# EAGLE design Amstrad-CPC-8255-PIO-2-0 (EAGLE 9.6.2)
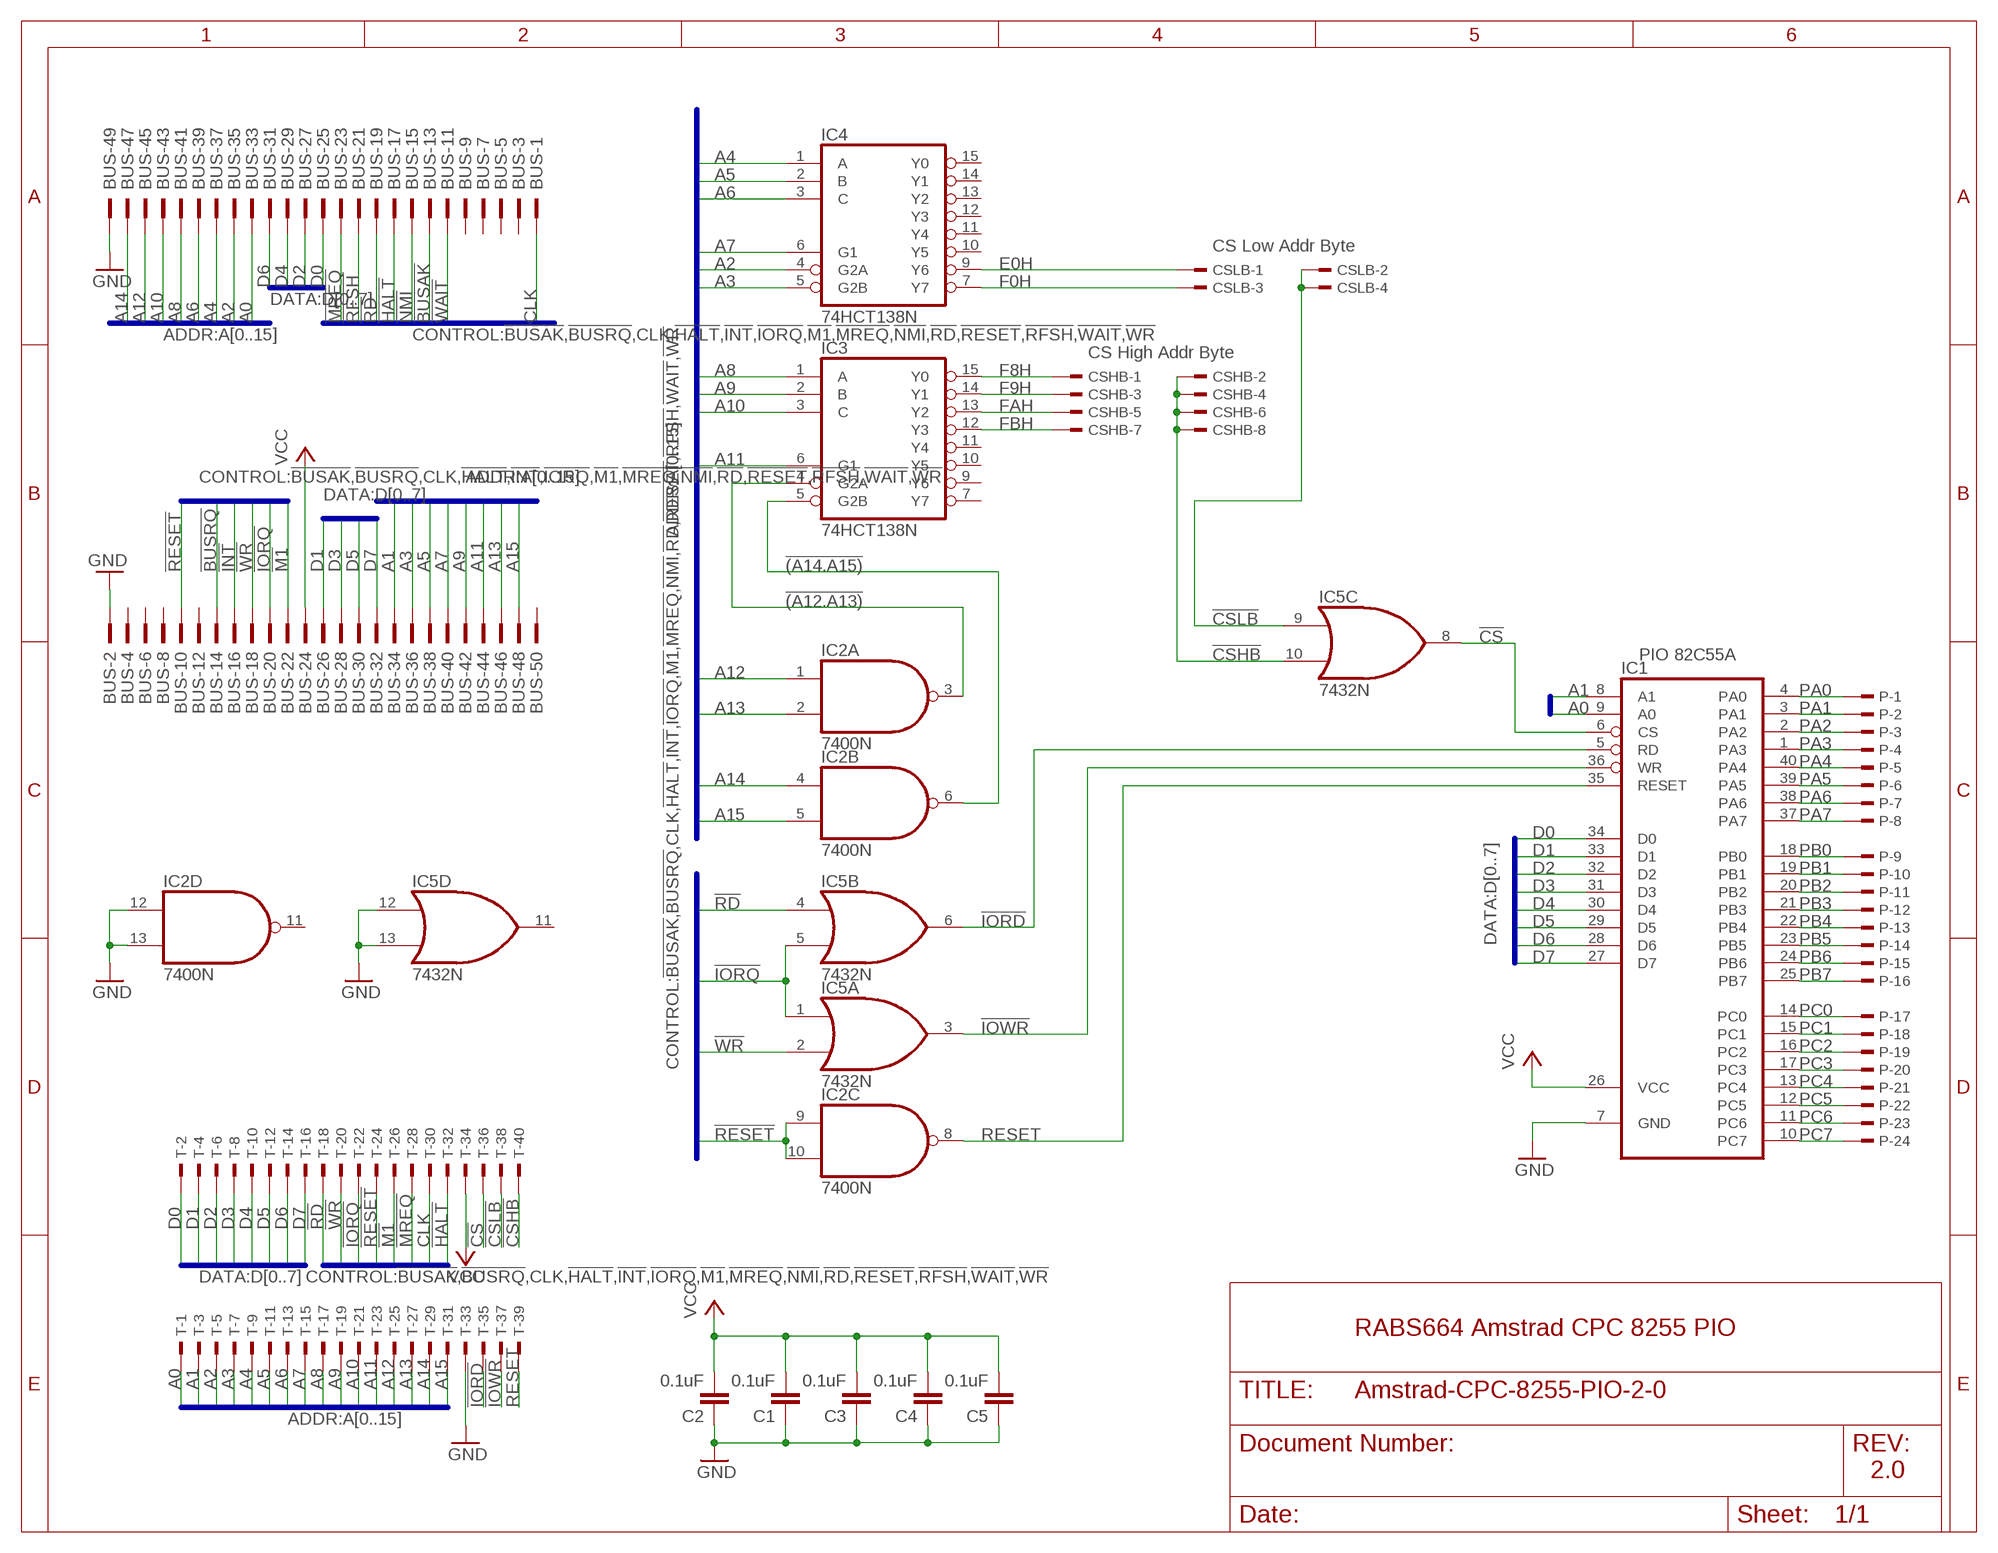
[diagram p0: schematic, sheet 1]

## Parts
BUS  2550-  [PAK100/2500-50]
C1  0.1uF  C-EU050-025X075  [C050-025X075]
C2  0.1uF  C-EU050-025X075  [C050-025X075]
C3  0.1uF  C-EU050-025X075  [C050-025X075]
C4  0.1uF  C-EU050-025X075  [C050-025X075]
C5  0.1uF  C-EU050-025X075  [C050-025X075]
CSHB  TSW-104-07-G-D  [TSW-104-XX-G-D]
CSLB  TSW-102-07-G-D  [TSW-102-XX-G-D]
IC1  82C55A  [DIL40]
IC2  7400N  [DIL14]
IC3  74HCT138N  [DIL16]
IC4  74HCT138N  [DIL16]
IC5  7432N  [DIL14]
P  TSW-124-07-G-S  [TSW-124-XX-G-S]
T  TSW-120-07-G-D  [TSW-120-XX-G-D]

## Nets
!(A12.A13): IC2.3(A:O) IC3.4(G2A)
!(A14.A15): IC2.6(B:O) IC3.5(G2B)
!BUSAK: BUS.13
!BUSRQ: BUS.14
!CS: IC1.6(CS) IC5.8(C:O) T.36
!CSHB: CSHB.2 CSHB.4 CSHB.6 CSHB.8 IC5.10(C:I1) T.40
!CSLB: CSLB.2 CSLB.4 IC5.9(C:I0) T.38
!HALT: BUS.17 T.32
!INT: BUS.16
!IORD: IC1.5(RD) IC5.6(B:O) T.35
!IORQ: BUS.20 IC5.1(A:I0) IC5.5(B:I1) T.22
!IOWR: IC1.36(WR) IC5.3(A:O) T.37
!M1: BUS.22 T.26
!MREQ: BUS.23 T.28
!NMI: BUS.15
!RD: BUS.19 IC5.4(B:I0) T.18
!RESET: BUS.10 IC2.9(C:I0) IC2.10(C:I1) T.24
!RFSH: BUS.21
!WAIT: BUS.11
!WR: BUS.18 IC5.2(A:I1) T.20
A0: BUS.33 IC1.9(A0) T.1
A1: BUS.34 IC1.8(A1) T.3
A2: BUS.35 IC4.4(G2A) T.5
A3: BUS.36 IC4.5(G2B) T.7
A4: BUS.37 IC4.1(A) T.9
A5: BUS.38 IC4.2(B) T.11
A6: BUS.39 IC4.3(C) T.13
A7: BUS.40 IC4.6(G1) T.15
A8: BUS.41 IC3.1(A) T.17
A9: BUS.42 IC3.2(B) T.19
A10: BUS.43 IC3.3(C) T.21
A11: BUS.44 IC3.6(G1) T.23
A12: BUS.45 IC2.1(A:I0) T.25
A13: BUS.46 IC2.2(A:I1) T.27
A14: BUS.47 IC2.4(B:I0) T.29
A15: BUS.48 IC2.5(B:I1) T.31
CLK: BUS.1 T.30
D0: BUS.25 IC1.34(D0) T.2
D1: BUS.26 IC1.33(D1) T.4
D2: BUS.27 IC1.32(D2) T.6
D3: BUS.28 IC1.31(D3) T.8
D4: BUS.29 IC1.30(D4) T.10
D5: BUS.30 IC1.29(D5) T.12
D6: BUS.31 IC1.28(D6) T.14
D7: BUS.32 IC1.27(D7) T.16
E0H: CSLB.1 IC4.9(Y6)
F0H: CSLB.3 IC4.7(Y7)
F8H: CSHB.1 IC3.15(Y0)
F9H: CSHB.3 IC3.14(Y1)
FAH: CSHB.5 IC3.13(Y2)
FBH: CSHB.7 IC3.12(Y3)
GND [supply]: BUS.2 BUS.49 C1.1 C2.1 C3.1 C4.1 C5.1 IC1.7(GND) IC2.12(D:I0) IC2.13(D:I1) IC5.12(D:I0) IC5.13(D:I1) T.33
PA0: IC1.4(PA0) P.1
PA1: IC1.3(PA1) P.2
PA2: IC1.2(PA2) P.3
PA3: IC1.1(PA3) P.4
PA4: IC1.40(PA4) P.5
PA5: IC1.39(PA5) P.6
PA6: IC1.38(PA6) P.7
PA7: IC1.37(PA7) P.8
PB0: IC1.18(PB0) P.9
PB1: IC1.19(PB1) P.10
PB2: IC1.20(PB2) P.11
PB3: IC1.21(PB3) P.12
PB4: IC1.22(PB4) P.13
PB5: IC1.23(PB5) P.14
PB6: IC1.24(PB6) P.15
PB7: IC1.25(PB7) P.16
PC0: IC1.14(PC0) P.17
PC1: IC1.15(PC1) P.18
PC2: IC1.16(PC2) P.19
PC3: IC1.17(PC3) P.20
PC4: IC1.13(PC4) P.21
PC5: IC1.12(PC5) P.22
PC6: IC1.11(PC6) P.23
PC7: IC1.10(PC7) P.24
RESET: IC1.35(RESET) IC2.8(C:O) T.39
VCC [supply]: BUS.24 C1.2 C2.2 C3.2 C4.2 C5.2 IC1.26(VCC) T.34
Unconnected: BUS.3 BUS.4 BUS.5 BUS.6 BUS.7 BUS.8 BUS.9 BUS.12 BUS.50 IC2.11(D:O) IC3.7(Y7) IC3.9(Y6) IC3.10(Y5) IC3.11(Y4) IC4.10(Y5) IC4.11(Y4) IC4.12(Y3) IC4.13(Y2) IC4.14(Y1) IC4.15(Y0) IC5.11(D:O)

## Buses
ADDR:A[0..15]
DATA:D[0..7]
CONTROL:!BUSAK,!BUSRQ,CLK,!HALT,!INT,!IORQ,!M1,!MREQ,!NMI,!RD,!RESET,!RFSH,!WAIT,!WR

## Notes on the sheet
- CS Low Addr Byte
- CS High Addr Byte
- PIO 82C55A
- RABS664 Amstrad CPC 8255 PIO
- 2.0

## Power pins joined to a net without a drawn wire
GND: IC2.7(P:GND) IC3.8(GND) IC4.8(GND) IC5.7(P:GND)
VCC: IC2.14(P:VCC) IC3.16(VCC) IC4.16(VCC) IC5.14(P:VCC)

## Library data of the parts
BUS = con-3m:2550-: 3M (TM) Pak 100 4-Wall Header Source: 3M; OC_FARNELL: unknown; OC_NEWARK: unknown; SPICEPREFIX: X
C1-C5 = rcl:C-EU: CAPACITOR, European symbol; SPICEPREFIX: C
CSHB = con-samtec:TSW-104-*-G: THROUGH-HOLE .025" SQ POST HEADER Source: Samtec TSW.pdf; MF: Samtec Inc.; MPN: TSW-104-07-G-D
CSLB = con-samtec:TSW-102-*-G: THROUGH-HOLE .025" SQ POST HEADER Source: Samtec TSW.pdf; MF: Samtec Inc.; MPN: TSW-102-07-G-D
IC1 = micro-intel:82C55A: MICROCOMPUTER/PERIPHERAL DEVICE; MF: INTERSIL; MPN: IP82C55AZ; OC_FARNELL: 1562050; OC_NEWARK: 79K6939
IC2 = 74xx-us:74*00: Quad 2-input NAND gate
IC3 IC4 = 74xx-eu:74*138: 3-line to 8-line DECODER/DEMULTIPLEXER
IC5 = 74xx-us:74*32: Quad 2-input OR gate
P = con-samtec:TSW-124-*-G-S: THROUGH-HOLE .025" SQ POST HEADER Source: Samtec TSW.pdf; MF: Samtec Inc.; MPN: TSW-124-07-G-S
T = con-samtec:TSW-120-*-G: THROUGH-HOLE .025" SQ POST HEADER Source: Samtec TSW.pdf; MF: Samtec Inc.; MPN: TSW-120-07-G-D

## Net classes
0 default: width 0.254 mm, clearance 0.254 mm
1 supply: width 0.508 mm, clearance 0.508 mm

## Board
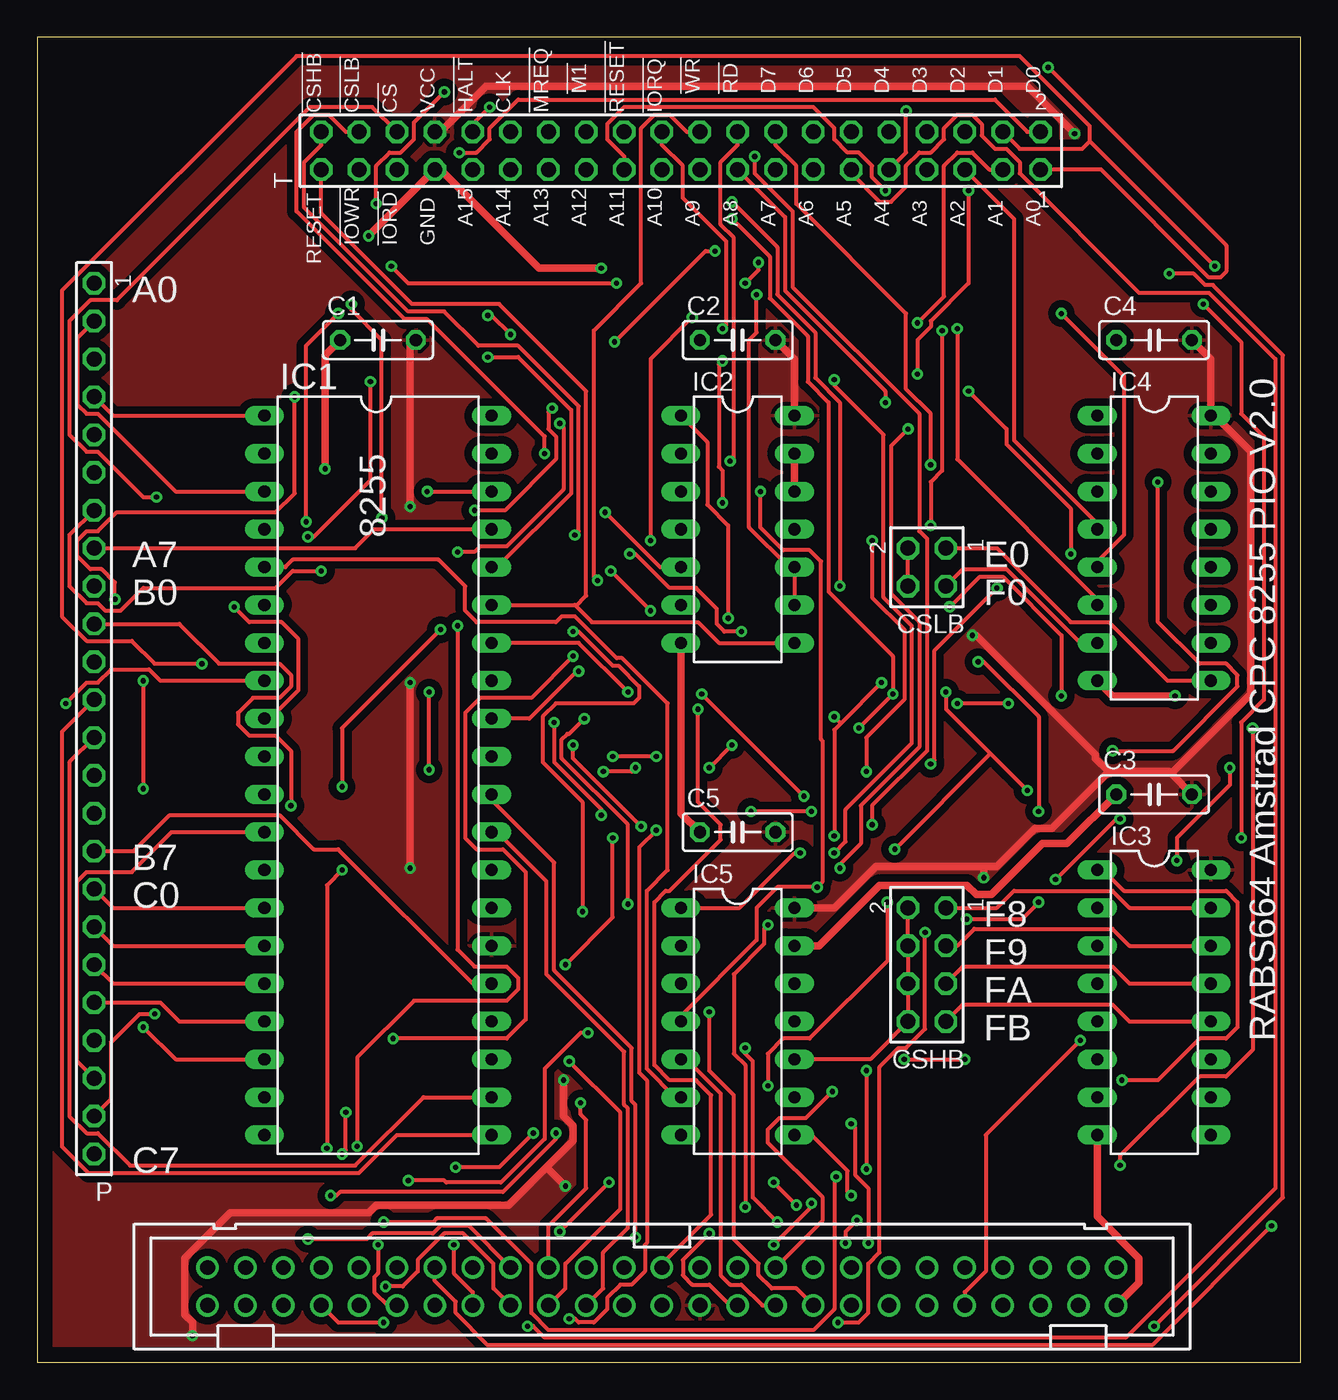
[diagram p1: board, top side]
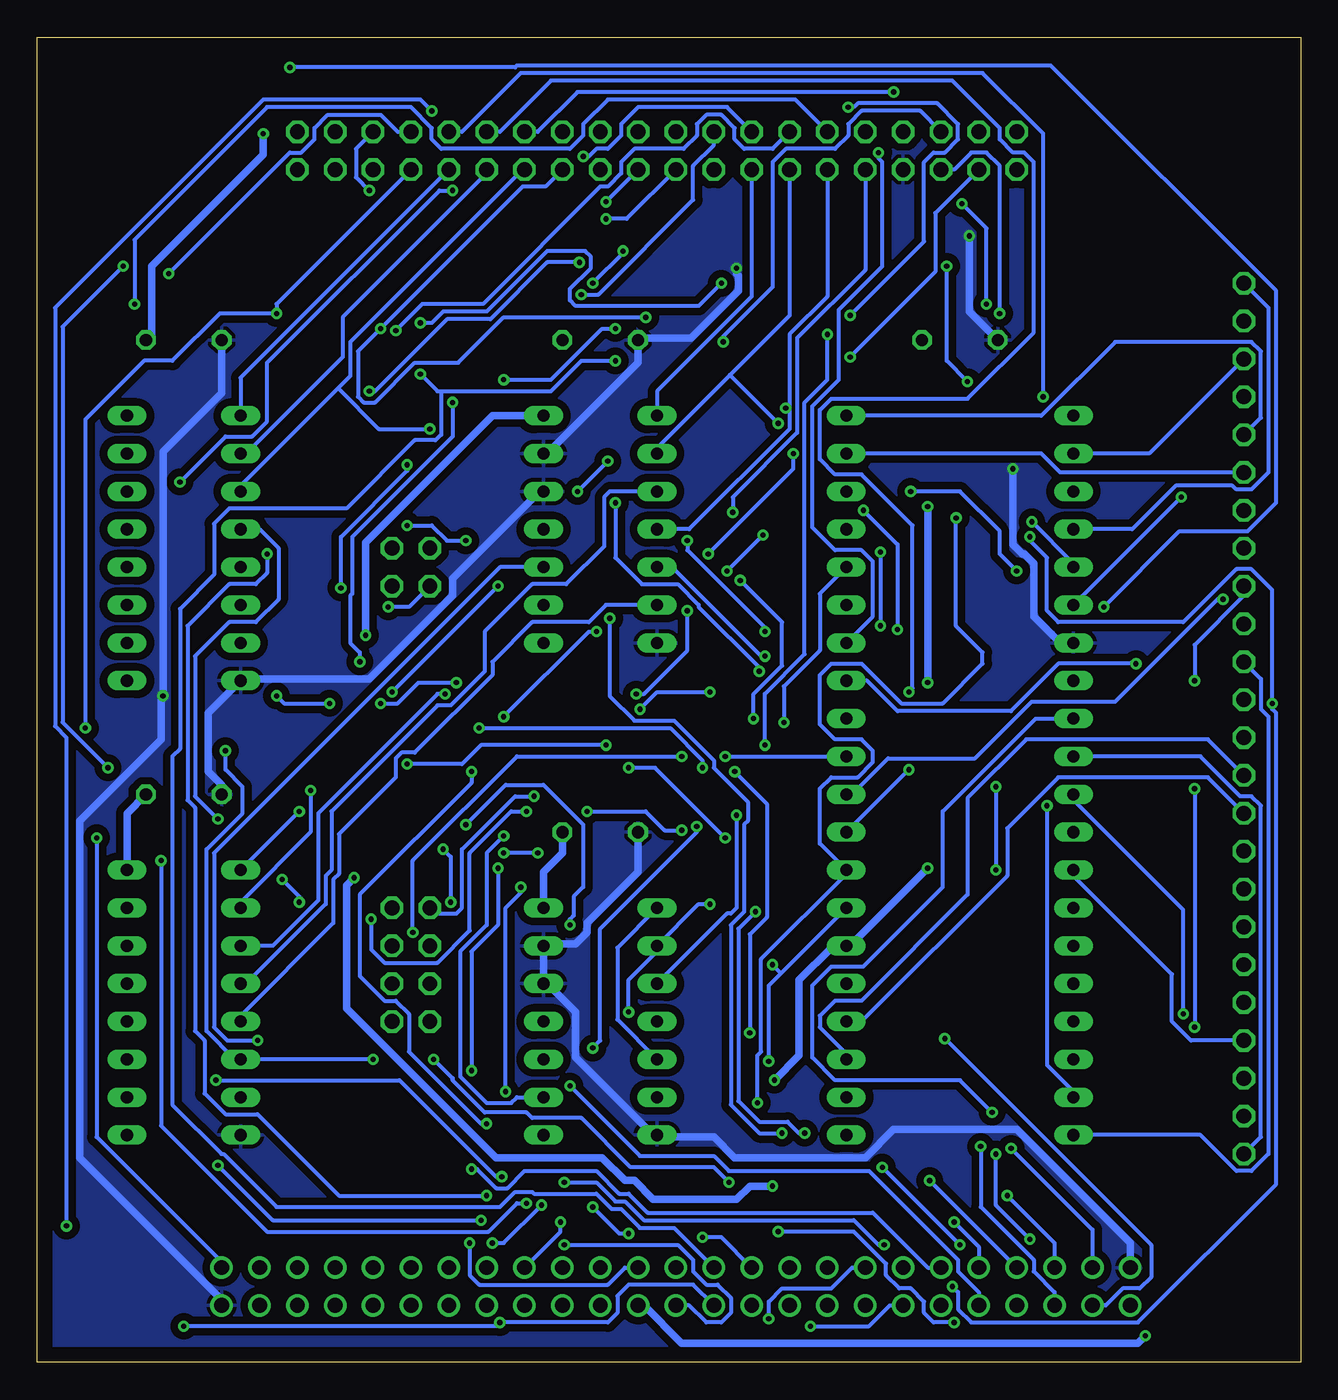
[diagram p2: board, bottom side, seen from below]

Size 84.76 x 88.89 mm. Coordinates in mm from the lower left corner, seen from the top.
Outline: 0,0 84.76,0 84.76,88.89 0,88.89 0,0
Copper layers (1*16): Top 0.035mm / dielectric 1.5mm / Bottom 0.035mm
Design rules "default": minimum track width 6mil, minimum drill 0.35mm, track to track 6mil, track to pad 6mil, pad to pad 6mil, via to via 6mil, smd to smd 6mil, copper to edge 40mil, drill to drill 6mil, minimum pad ring 10mil, minimum via ring 8mil, stop-mask expansion 4mil, vias tented up to drill 0mil, thermal gap 10mil

### Footprints (pad centres in the part's own frame; a part is rotated, then mirrored left to right if it is on the bottom)
PAK100/2500-50 = drill 1 pad 1.422: 1 -30.48,-1.27; 2 -30.48,1.27; 3 -27.94,-1.27; 4 -27.94,1.27; 5 -25.4,-1.27; 6 -25.4,1.27; 7 -22.86,-1.27; 8 -22.86,1.27; 9 -20.32,-1.27; 10 -20.32,1.27; 11 -17.78,-1.27; 12 -17.78,1.27; 13 -15.24,-1.27; 14 -15.24,1.27; 15 -12.7,-1.27; 16 -12.7,1.27; 17 -10.16,-1.27; 18 -10.16,1.27; 19 -7.62,-1.27; 20 -7.62,1.27; 21 -5.08,-1.27; 22 -5.08,1.27; 23 -2.54,-1.27; 24 -2.54,1.27; 25 0,-1.27; 26 0,1.27; 27 2.54,-1.27; 28 2.54,1.27; 29 5.08,-1.27; 30 5.08,1.27; 31 7.62,-1.27; 32 7.62,1.27; 33 10.16,-1.27; 34 10.16,1.27; 35 12.7,-1.27; 36 12.7,1.27; 37 15.24,-1.27; 38 15.24,1.27; 39 17.78,-1.27; 40 17.78,1.27; 41 20.32,-1.27; 42 20.32,1.27; 43 22.86,-1.27; 44 22.86,1.27; 45 25.4,-1.27; 46 25.4,1.27; 47 27.94,-1.27; 48 27.94,1.27; 49 30.48,-1.27; 50 30.48,1.27
C050-025X075 = drill 0.813 octagon: 1 -2.54,0; 2 2.54,0
TSW-104-XX-G-D = drill 1 pad 1.5 octagon: 1 3.81,-1.27; 2 3.81,1.27; 3 1.27,-1.27; 4 1.27,1.27; 5 -1.27,-1.27; 6 -1.27,1.27; 7 -3.81,-1.27; 8 -3.81,1.27
TSW-102-XX-G-D = drill 1 pad 1.5 octagon: 1 1.27,-1.27; 2 1.27,1.27; 3 -1.27,-1.27; 4 -1.27,1.27
DIL40 = drill 0.813 long: 1 -24.13,-7.62; 2 -21.59,-7.62; 3 -19.05,-7.62; 4 -16.51,-7.62; 5 -13.97,-7.62; 6 -11.43,-7.62; 7 -8.89,-7.62; 8 -6.35,-7.62; 9 -3.81,-7.62; 10 -1.27,-7.62; 11 1.27,-7.62; 12 3.81,-7.62; 13 6.35,-7.62; 14 8.89,-7.62; 15 11.43,-7.62; 16 13.97,-7.62; 17 16.51,-7.62; 18 19.05,-7.62; 19 21.59,-7.62; 20 24.13,-7.62; 21 24.13,7.62; 22 21.59,7.62; 23 19.05,7.62; 24 16.51,7.62; 25 13.97,7.62; 26 11.43,7.62; 27 8.89,7.62; 28 6.35,7.62; 29 3.81,7.62; 30 1.27,7.62; 31 -1.27,7.62; 32 -3.81,7.62; 33 -6.35,7.62; 34 -8.89,7.62; 35 -11.43,7.62; 36 -13.97,7.62; 37 -16.51,7.62; 38 -19.05,7.62; 39 -21.59,7.62; 40 -24.13,7.62
DIL14 = drill 0.813 long: 1 -7.62,-3.81; 2 -5.08,-3.81; 3 -2.54,-3.81; 4 0,-3.81; 5 2.54,-3.81; 6 5.08,-3.81; 7 7.62,-3.81; 8 7.62,3.81; 9 5.08,3.81; 10 2.54,3.81; 11 0,3.81; 12 -2.54,3.81; 13 -5.08,3.81; 14 -7.62,3.81
DIL16 = drill 0.813 long: 1 -8.89,-3.81; 2 -6.35,-3.81; 3 -3.81,-3.81; 4 -1.27,-3.81; 5 1.27,-3.81; 6 3.81,-3.81; 7 6.35,-3.81; 8 8.89,-3.81; 9 8.89,3.81; 10 6.35,3.81; 11 3.81,3.81; 12 1.27,3.81; 13 -1.27,3.81; 14 -3.81,3.81; 15 -6.35,3.81; 16 -8.89,3.81
TSW-124-XX-G-S = drill 1 pad 1.5 octagon: 1 29.21,0; 2 26.67,0; 3 24.13,0; 4 21.59,0; 5 19.05,0; 6 16.51,0; 7 13.97,0; 8 11.43,0; 9 8.89,0; 10 6.35,0; 11 3.81,0; 12 1.27,0; 13 -1.27,0; 14 -3.81,0; 15 -6.35,0; 16 -8.89,0; 17 -11.43,0; 18 -13.97,0; 19 -16.51,0; 20 -19.05,0; 21 -21.59,0; 22 -24.13,0; 23 -26.67,0; 24 -29.21,0
TSW-120-XX-G-D = drill 1 pad 1.5 octagon: 1 24.13,-1.27; 2 24.13,1.27; 3 21.59,-1.27; 4 21.59,1.27; 5 19.05,-1.27; 6 19.05,1.27; 7 16.51,-1.27; 8 16.51,1.27; 9 13.97,-1.27; 10 13.97,1.27; 11 11.43,-1.27; 12 11.43,1.27; 13 8.89,-1.27; 14 8.89,1.27; 15 6.35,-1.27; 16 6.35,1.27; 17 3.81,-1.27; 18 3.81,1.27; 19 1.27,-1.27; 20 1.27,1.27; 21 -1.27,-1.27; 22 -1.27,1.27; 23 -3.81,-1.27; 24 -3.81,1.27; 25 -6.35,-1.27; 26 -6.35,1.27; 27 -8.89,-1.27; 28 -8.89,1.27; 29 -11.43,-1.27; 30 -11.43,1.27; 31 -13.97,-1.27; 32 -13.97,1.27; 33 -16.51,-1.27; 34 -16.51,1.27; 35 -19.05,-1.27; 36 -19.05,1.27; 37 -21.59,-1.27; 38 -21.59,1.27; 39 -24.13,-1.27; 40 -24.13,1.27

### Placement (x,y rotation side)
BUS  41.91,5.08 180 top
C1  22.86,68.58 0 top
C2  46.99,68.58 0 top
C3  74.93,38.1 0 top
C4  74.93,68.58 0 top
C5  46.99,35.56 0 top
CSHB  59.69,26.67 90 top
CSLB  59.69,53.34 90 top
IC1  22.86,39.37 270 top
IC2  46.99,55.88 270 top
IC3  74.93,24.13 270 top
IC4  74.93,54.61 270 top
IC5  46.99,22.86 270 top
P  3.81,43.18 90 top
T  43.18,81.28 0 top

### Tracks (layer width: path | path; a pad name or v marks a point on that pad's centre or on a via)
!(A12.A13)
  Bottom 0.254: IC3.4 70.74,25.4 65.41,30.73 65.41,32.64 65.02,33.02 65.02,36.96 57.91,44.07 57.02,44.07 54.74,46.35 54.74,49.02 51.56,52.2 49.28,52.2 46.74,54.74 46.74,58.04 46.36,58.42 IC2.3
!(A14.A15)
  Bottom 0.254: IC3.5 71.12,23.24 64.9,29.46 64.9,32.38 64.52,32.77 64.52,35.43 60.71,39.24 60.71,40.51 60.33,40.89 59.44,40.89 54.23,46.1 54.23,46.99 51.56,49.66 47.75,49.66 46.61,50.8 IC2.6
!CS  (via drill 0.35)
  Top 0.254: v8,58.04 7.11,58.04 4.06,61.09 3.3,61.09 2.16,62.23 2.16,69.85 3.56,71.25 5.33,71.25 18.29,84.2 22.48,84.2 T.36 | IC5.8 51.94,15.24 54.36,12.83 54.36,11.43 v54.61,11.18 | v69.34,54.23 69.34,57.28 65.02,61.59 65.02,62.61 v62.48,65.15 | v48.39,73.79 48.39,73.28 v47.5,72.39 | v45.47,74.55 44.83,74.55 v38.74,68.45
  Bottom 0.254: v8,58.04 IC1.6 | v54.61,11.18 64.52,11.18 69.98,16.64 72.14,16.64 73.53,18.03 73.53,21.59 74.17,22.23 74.17,37.21 74.68,37.72 74.68,49.4 71.88,52.2 70.1,52.2 69.34,52.96 v69.34,54.23 | v62.48,65.15 62.1,65.15 57.28,69.98 54.36,69.98 50.55,73.79 v48.39,73.79 | v47.5,72.39 45.47,74.42 v45.47,74.55 | v38.74,68.45 38.74,68.83 35.43,72.14 35.43,80.52 34.54,81.41 31.24,81.41 30.35,82.3 30.35,83.06 29.46,83.95 25.53,83.95 T.36
!CSHB  (via drill 0.35)
  Top 0.254: IC5.10 55.88,20.32 CSHB.8 CSHB.6 CSHB.4 CSHB.2 | T.40 19.05,81.66 17.91,80.52 17.91,77.47 24.89,70.48 27.3,70.48 29.59,68.2 32.26,68.2 36.32,64.14 36.32,55.75 v36.07,55.5 | v41.15,50.42 v38.48,53.09 | v51.44,37.97 v44.58,44.83
  Bottom 0.254: v38.48,53.09 v36.07,55.5 | v41.15,50.42 41.15,47.75 44.07,44.83 v44.58,44.83 | v51.44,37.97 52.71,37.97 56.26,34.42 56.26,30.48 56.64,30.1 58.04,30.1 CSHB.2
!CSLB  (via drill 0.35)
  Top 0.254: v53.47,35.31 53.47,42.42 53.91,42.86 | v56.64,45.59 53.91,42.86 | v65.15,44.2 v61.72,44.2 | v68.71,44.7 68.71,48.77 64.77,52.7 63.25,52.7 v61.21,50.67 | CSLB.4 CSLB.2 | T.38 20.7,82.55 19.56,83.69 18.54,83.69 17.4,82.55 17.4,77.22 24.64,69.98 26.16,69.98 34.04,62.1 v34.04,60.96 | v39.75,54.23 40.13,54.23 42.42,51.94 44.2,51.94 45.59,50.55 45.59,49.53 46.1,49.02 v47.24,49.02 | 53.91,42.86 v53.47,43.31
  Bottom 0.254: IC5.9 52.58,17.78 52.96,17.4 54.61,17.4 56.39,19.18 56.39,27.56 54.61,29.34 54.61,34.16 v53.47,35.31 | v56.64,45.59 59.18,45.59 60.58,44.2 v61.72,44.2 | v65.15,44.2 68.2,44.2 v68.71,44.7 | v61.21,50.67 59.82,50.67 CSLB.4 | v34.04,60.96 34.04,59.94 v39.75,54.23 | v47.24,49.02 47.75,49.02 v53.47,43.31
!HALT  (via drill 0.35)
  Top 0.254: T.32 29.21,83.06 v30.35,84.2 | v30.23,70.23 30.48,70.23 v31.75,68.96 | v35.94,41.4 35.94,40.51 v40.51,35.94 | v47.5,21.08 47.5,20.7 48.01,20.19 48.01,11.05 v49.66,9.4
  Bottom 0.254: v30.35,84.2 29.97,84.2 29.72,84.45 24.38,84.45 22.99,83.06 22.99,82.04 23.88,81.15 24.64,81.15 25.27,80.52 25.27,75.18 v30.23,70.23 | v31.75,68.96 31.75,65.91 33.27,64.39 33.27,47.5 35.94,44.83 v35.94,41.4 | v40.51,35.94 40.51,35.56 46.99,29.08 46.99,21.59 v47.5,21.08 | v49.66,9.4 49.66,8.76 BUS.17
!IORD  (via drill 0.35)
  Top 0.254: IC1.5 16.64,53.34 17.14,53.85 26.92,53.85 28.7,52.07 28.7,50.42 29.46,49.66 34.8,49.66 35.18,50.04 36.07,50.04 38.86,47.24 39.24,47.24 42.29,44.2 42.29,33.02 40.89,31.62 40.89,19.68 42.8,17.78 IC5.6 | v20.19,70.36 18.03,68.2 v18.03,56.39
  Bottom 0.254: T.35 23.24,80.01 22.1,81.15 21.08,81.15 20.19,80.26 v20.19,70.36 | v18.03,56.39 15.24,53.59 IC1.5
!IORQ  (via drill 0.35)
  Top 0.254: BUS.20 48.64,3.81 47.24,5.21 46.48,5.21 45.85,5.84 45.85,18.03 43.56,20.32 IC5.5 | T.22 41.91,81.66 43.31,80.26 43.31,78.11 46.23,75.18 46.23,69.6 v45.97,69.34 | v53.47,65.91 53.47,65.53 56.77,62.23 56.77,51.31 58.67,49.4 58.67,41.53 54.23,37.08 54.23,34.92 v53.47,34.16 | v51.18,34.16 50.8,34.16 47.12,30.48 IC5.1
  Bottom 0.254: IC5.5 45.85,22.99 45.85,27.81 IC5.1 | v45.97,69.34 46.86,69.34 50.29,65.91 v53.47,65.91 | v51.18,34.16 v53.47,34.16
!IOWR  (via drill 0.35)
  Top 0.254: IC1.36 30.86,53.34 35.81,58.29 35.81,63.88 32.26,67.44 v30.23,67.44 | v37.85,36.7 37.85,37.08 34.67,40.26 v34.67,42.93
  Bottom 0.254: v30.23,67.44 24.51,73.15 24.51,77.09 T.37 | IC5.3 38.48,30.1 38.23,30.1 37.85,30.48 v37.85,36.7 | v34.67,42.93 34.67,45.34 32.26,47.75 32.26,51.56 IC1.36
!M1  (via drill 0.35)
  Top 0.254: BUS.22 46.48,3.81 45.09,5.21 43.94,5.21 43.31,5.84 43.31,6.86 v45.09,8.64 | v47.5,10.41 47.5,19.94 46.74,20.7 46.74,26.04 48.77,28.07 48.77,29.08 v49.02,29.34 | v56.01,36.07 56.01,37.34 59.69,41.02 59.69,55.24 59.18,55.75 59.18,63.63 50.67,72.14 50.67,77.22 48.13,79.76 v48.13,80.9
  Bottom 0.254: v45.09,8.64 45.72,8.64 v47.5,10.41 | v49.02,29.34 49.02,29.72 48.77,29.97 48.77,31.24 48.13,31.88 48.13,36.07 50.8,38.73 53.34,38.73 v56.01,36.07 | v48.13,80.9 47.75,80.9 47.24,81.41 46.48,81.41 45.59,82.3 45.59,83.06 44.45,84.2 38.48,84.2 T.26
!MREQ  (via drill 0.35)
  Top 0.254: v55.75,8 55.75,11.68 54.86,12.57 54.86,15.75 v54.61,16 | v55.63,39.62 55.63,41.91 58.17,44.45 58.17,49.15 56.01,51.31 v56.01,55.12 | v59.94,56.13 59.94,59.05 60.71,59.82 v60.71,69.22
  Bottom 0.254: BUS.23 45.34,6.35 46.48,5.21 55.12,5.21 55.75,5.84 v55.75,8 | v54.61,16 54.99,16 59.82,20.83 59.82,23.37 60.71,24.26 61.47,24.26 63.12,25.91 63.12,31.37 55.63,38.86 v55.63,39.62 | v56.01,55.12 57.28,55.12 58.29,56.13 v59.94,56.13 | v60.71,69.22 58.93,70.99 54.86,70.99 46.99,78.87 46.48,78.87 45.59,79.76 45.59,80.52 44.7,81.41 41.4,81.41 40.51,82.3 40.51,83.06 39.88,83.69 38.86,83.69 37.97,82.8 37.97,82.04 37.34,81.41 35.43,81.41 T.28
!RD  (via drill 0.35)
  Top 0.254: IC5.4 43.18,23.24 48.26,28.32 48.26,30.48 49.66,31.88 v52.32,31.88 52.71,32.26 52.71,41.66 52.58,41.78 52.58,53.72 51.82,54.48 50.04,54.48 48.51,56.01 v48.51,58.42 | v53.34,18.16 51.56,16.38 49.78,16.38 49.02,15.62 49.02,14.73 52.71,11.05 52.71,9.53 BUS.19 | T.18 46.99,81.66 45.85,80.52 45.85,76.33 46.74,75.44 46.74,60.71 v46.48,60.45
  Bottom 0.254: v52.32,31.88 52.32,31.5 53.34,30.48 v53.34,18.16 | v48.51,58.42 v46.48,60.45
!RESET  (via drill 0.35)
  Top 0.254: IC2.9 IC2.10 50.42,53.34 47.75,56.01 47.75,68.58 48.26,69.09 v48.26,71.63 | BUS.10 62.23,4.7 63.63,6.1 63.63,15.24 v69.98,21.59
  Bottom 0.254: v69.98,21.59 72.01,21.59 72.9,22.48 72.9,34.16 53.72,53.34 IC2.10 | T.24 39.37,81.66 40.77,80.26 40.77,77.98 47.12,71.63 v48.26,71.63
!WR  (via drill 0.35)
  Top 0.254: v45.09,23.5 45.09,19.56 46.74,17.91 46.74,8.26 48.39,6.6 48.39,5.84 49.28,4.95 50.93,4.95 BUS.18 | T.20 43.56,82.55 42.42,83.69 41.4,83.69 40.51,82.8 40.51,72.39 37.34,69.22 37.34,52.7 v37.59,52.45 | v36.7,43.18 35.69,42.16 35.56,42.16 35.18,41.78 35.18,40.51 39.62,36.07 v39.62,30.73
  Bottom 0.254: v45.09,23.5 45.09,25.65 43.18,27.56 IC5.2 40.39,30.73 v39.62,30.73 | v37.59,52.45 34.8,49.66 34.8,46.74 36.7,44.83 v36.7,43.18
A0  (via drill 0.35)
  Top 0.254: v20.7,16.76 20.7,14.22 v20.45,13.97 | v18.16,8.26 22.1,8.26 22.48,8.64 26.54,8.64 27.05,9.14 28.96,9.14 BUS.33 | T.1 71.37,80.01 78.61,72.77 79.38,72.77 79.76,73.15 79.76,74.93 v67.82,86.87 | v13.21,50.67 14.22,49.66 16.38,49.66 17.53,48.51 17.53,45.09 15.62,43.18 IC1.9
  Bottom 0.254: IC1.9 17.78,43.18 24,36.96 24,31.88 29.34,26.54 31.5,26.54 32.77,25.27 32.77,20.45 31.24,18.92 22.86,18.92 v20.7,16.76 | v20.45,13.97 20.45,10.54 v18.16,8.26 | v67.82,86.87 52.71,86.87 52.58,87 16.76,87 1.65,71.88 1.65,57.66 3.56,55.75 8.13,55.75 v13.21,50.67
A1  (via drill 0.35)
  Top 0.254: IC1.8 8.26,45.72 7.49,46.48 4.95,46.48 4.06,45.59 3.3,45.59 v1.91,44.2 | v23.37,5.08 24.51,5.08 25.53,6.1 25.53,6.86 27.3,8.64 28.57,8.64 30.61,6.6 30.61,4.95 BUS.34 | T.3 63.88,80.01 62.74,81.15 61.72,81.15 60.83,80.26 60.83,71.5 v59.05,69.72 | v38.86,72.39 24.89,72.39 v23.75,73.53 | v22.35,65.79 22.35,59.18 18.54,55.37 v18.16,55.37
  Bottom 0.254: v23.37,5.08 22.99,4.7 22.99,3.56 22.1,2.67 10.92,2.67 1.65,11.94 1.65,43.56 1.91,43.81 v1.91,44.2 1.91,51.82 3.3,53.21 4.32,53.21 7.87,49.66 16.26,49.66 17.02,50.42 17.02,53.98 18.16,55.12 v18.16,55.37 | v59.05,69.72 58.29,69.72 57.53,70.48 54.61,70.48 50.55,74.55 48.01,74.55 47.62,74.17 47.62,73.41 49.02,72.01 49.02,71.25 48.64,70.87 40.39,70.87 v38.86,72.39 | v23.75,73.53 23.75,67.18 v22.35,65.79
A2  (via drill 0.35)
  Top 0.254: IC4.4 71.12,56.26 65.53,61.85 65.53,76.71 T.5 | v35.69,2.92 36.07,2.92 36.32,2.67 37.34,2.67 38.23,3.56 38.23,4.32 39.12,5.21 39.88,5.21 40.77,6.1 40.77,7.87 40.89,8 40.89,18.92 40.39,19.43 40.39,34.54 v41.53,35.69 | v51.94,36.96 v47.88,36.96 | v62.36,29.72 66.04,29.72 v67.18,30.86 | v68.33,32.38 72.39,36.45 v72.64,36.45
  Bottom 0.254: BUS.35 30.1,6.35 31.5,4.95 34.8,4.95 35.69,4.06 v35.69,2.92 | v41.53,35.69 42.67,35.69 43.94,36.96 v47.88,36.96 | v51.94,36.96 52.96,36.96 55.75,34.16 55.75,28.96 57.91,26.8 61.47,26.8 62.36,27.69 v62.36,29.72 | v67.18,30.86 67.18,31.24 v68.33,32.38 | v72.64,36.45 74.17,37.97 74.17,47.37 71.88,49.66 70.1,49.66 68.58,51.18 68.58,54.61 69.85,55.88 IC4.4
A3  (via drill 0.35)
  Top 0.254: IC4.5 71.12,53.72 72.9,55.5 72.9,66.17 v68.71,70.36 | BUS.36 29.21,4.7 27.94,5.97 v27.94,7.87 | v50.93,10.54 v49.4,12.06 | v54.23,8 54.23,8.76 v54.99,9.53 | v72.64,13.21 72.64,13.84 77.98,19.18 79.76,19.18 81.53,20.95 v81.53,42.55
  Bottom 0.254: T.7 68.71,70.99 v68.71,70.36 72.52,70.36 75.69,67.18 77.6,67.18 81.53,63.25 v81.53,42.55 | v27.94,7.87 28.32,7.87 29.97,9.53 44.07,9.53 45.34,10.79 45.97,10.79 47.24,12.06 v49.4,12.06 | v50.93,10.54 53.47,8 v54.23,8 | v54.99,9.53 68.96,9.53 v72.64,13.21
A4  (via drill 0.35)
  Top 0.254: BUS.37 26.67,5.46 28.07,4.06 28.07,3.3 30.23,1.14 74.8,1.14 v82.8,9.14 | v58.29,83.95 58.29,81.15 T.9
  Bottom 0.254: IC4.1 71.12,66.04 T.9 | v82.8,9.14 82.8,41.91 83.57,42.67 83.57,70.74 69.6,84.71 59.05,84.71 v58.29,83.95
A5  (via drill 0.35)
  Top 0.254: v32.89,2.41 33.27,2.41 34.04,1.65 73.02,1.65 83.06,11.68 83.06,67.31 78.61,71.75 73.91,71.75 65.91,79.76 65.91,80.52 65.02,81.41 64.26,81.41 63.37,82.3 63.37,83.06 62.74,83.69 61.72,83.69 60.83,82.8 60.83,82.04 59.94,81.15 59.18,81.15 58.29,80.26 58.29,78.87 57.28,77.85 56.52,77.85 54.61,79.76 T.11
  Bottom 0.254: IC4.2 70.74,60.96 64.26,67.44 64.26,70.1 54.61,79.76 T.11 | BUS.38 27.56,3.81 28.96,2.41 v32.89,2.41
A6  (via drill 0.35)
  Top 0.254: v55.63,19.56 v55.63,12.95 | v53.85,33.15 53.85,33.4 55.25,34.8 55.25,37.34 59.18,41.27 59.18,49.66 57.28,51.56 57.28,61.47 v58.42,62.61
  Bottom 0.254: IC4.3 71.12,58.8 64.58,65.34 | 64.58,65.34 63.75,66.17 63.75,68.45 52.2,80.01 T.13 | BUS.39 25.02,6.35 28.7,10.03 43.82,10.03 45.09,11.3 45.72,11.3 47.24,12.83 52.07,12.83 53.21,11.68 53.98,11.68 55.25,12.95 v55.63,12.95 | v55.63,19.56 55.63,27.56 53.85,29.34 v53.85,33.15 | v58.42,62.61 61.85,62.61 64.58,65.34
A7  (via drill 0.35)
  Top 0.254: IC4.6 71.12,51.18 61.72,60.58 v61.72,69.34 | BUS.40 23.5,3.81 22.61,4.7 22.61,5.71 22.86,5.97 v22.86,7.87 | v28.07,13.08 30.99,13.08 v33.27,15.37 | v36.58,30.23 36.58,37.59 33.91,40.26 33.91,43.31 34.8,44.2 40.01,44.2 40.39,44.58 40.39,45.34 38.99,46.74 38.61,46.74 36.32,49.02 v35.94,49.02 | v41.15,55.12 41.15,67.31 v43.94,70.1
  Bottom 0.254: T.15 50.67,78.87 52.2,78.87 v61.72,69.34 63.25,67.82 63.25,64.77 62.87,64.39 62.1,64.39 59.44,67.06 56.52,67.06 53.47,70.1 v43.94,70.1 | v28.07,13.08 v22.86,7.87 | v33.27,15.37 33.66,15.37 34.42,16.13 36.32,16.13 37.72,17.53 37.72,29.08 v36.58,30.23 | v35.94,49.02 35.94,49.28 41.15,54.48 v41.15,55.12
A8  (via drill 0.35)
  Top 0.254: v67.18,36.96 67.18,43.31 63.5,46.99 v63.12,46.99 | v56.9,64.39 56.9,65.15 50.17,71.88 50.17,76.83 T.17 | v23.24,9.4 26.54,9.4 26.8,9.65 30.1,9.65 33.15,6.6 33.15,3.3 34.29,2.16 52.07,2.16 53.47,3.56 53.47,12.32 v53.59,12.45 | v72.77,18.92 75.18,18.92 77.98,21.72 79.76,21.72 80.52,22.48 80.52,30.86 79.76,31.62 72.9,31.62 71.5,33.02 IC3.1
  Bottom 0.254: v67.18,36.96 IC3.1 | v63.12,46.99 63.12,47.62 63.75,48.26 63.75,51.44 63.63,51.56 63.63,55.37 56.9,62.1 v56.9,64.39 | BUS.41 21.59,7.75 v23.24,9.4 | v53.59,12.45 53.98,12.45 60.45,18.92 v72.77,18.92
A9  (via drill 0.35)
  Top 0.254: 63.95,40.83 60.96,43.81 v60.96,44.96 | 63.95,40.83 v66.42,38.35 | v53.85,52.07 53.85,64.39 52.2,66.04 52.2,69.09 49.66,71.63 49.66,74.8 v46.61,77.85 | v49.02,18.54 49.02,20.7 50.04,21.72 51.82,21.72 57.02,26.92 v57.02,30.86 | 63.95,40.83 v57.53,34.42
  Bottom 0.254: IC3.2 71.12,30.86 66.42,35.56 v66.42,38.35 | v53.85,52.07 v60.96,44.96 | T.19 v46.61,77.85 | BUS.42 21.59,4.7 22.99,6.1 22.99,6.86 28.96,12.83 38.35,12.83 39.37,13.84 44.32,13.84 v49.02,18.54 | v57.02,30.86 57.02,33.91 v57.53,34.42
A10  (via drill 0.35)
  Top 0.254: v46.61,76.71 49.15,74.17 49.15,71.37 51.69,68.83 51.69,65.79 53.09,64.39 53.09,51.69 57.4,47.37 v57.4,44.83 v55.12,42.55 | v24.89,12.19 27.3,12.19 27.43,12.06 31.11,12.06 34.04,14.99 34.04,19.68 36.45,22.1 v36.96,22.1 | v37.97,39.62 39.88,39.62 v40.13,39.88
  Bottom 0.254: IC3.3 68.96,27.94 65.91,30.99 65.91,36.83 57.91,44.83 v57.4,44.83 | v46.61,76.71 45.21,76.71 T.21 | v24.89,12.19 BUS.43 | v36.96,22.1 36.96,28.7 35.81,29.84 35.81,37.47 v37.97,39.62 | v40.13,39.88 40.13,40.39 42.29,42.55 v55.12,42.55
A11  (via drill 0.35)
  Top 0.254: v58.17,20.32 v62.23,20.32 | v35.05,8.76 v38.35,12.06 | v23.24,2.67 20.19,2.67 BUS.44 | T.23 39.37,80.9 38.23,82.04 38.23,83.06 39.37,84.2 52.07,84.2 53.47,82.8 53.47,82.04 54.36,81.15 55.12,81.15 56.01,80.26 56.01,79.5 v56.9,78.61 | v75.18,59.05 75.18,49.66 77.98,46.86 79.76,46.86 80.52,46.1 80.52,45.34 76.2,41.02 v72.14,41.02
  Bottom 0.254: v62.23,20.32 IC3.6 71.5,20.32 73.41,22.23 73.41,34.42 70.99,36.83 70.99,38.61 72.14,39.75 v72.14,41.02 | v58.17,20.32 56.9,19.05 56.9,18.92 54.74,16.76 51.94,16.76 51.56,16.38 48.26,16.38 44.96,13.08 39.37,13.08 v38.35,12.06 | v35.05,8.76 29.97,8.76 27.81,6.6 27.81,5.84 26.92,4.95 26.16,4.95 25.27,4.06 25.27,3.3 24.64,2.67 v23.24,2.67 | v56.9,78.61 57.79,78.61 69.34,67.06 69.34,63.12 70.36,62.1 72.14,62.1 v75.18,59.05
A12  (via drill 0.35)
  Top 0.254: v19.68,11.18 20.07,11.18 20.32,11.43 31.24,11.43 34.8,14.99 v34.8,15.37 | v46.36,49.91 46.36,56.13 44.96,57.53 44.96,61.72 IC2.1
  Bottom 0.254: IC2.1 43.18,65.15 36.83,71.5 T.25 | BUS.45 16.51,8 v19.68,11.18 | v34.8,15.37 36.32,15.37 38.23,17.27 38.23,29.34 37.34,30.23 37.34,36.07 37.08,36.32 37.08,37.59 39.37,39.88 39.37,40.39 42.04,43.05 44.7,43.05 46.36,44.7 v46.36,49.91
A13  (via drill 0.35)
  Top 0.254: v21.46,14.48 21.46,20.45 25.27,24.26 31.5,24.26 32.26,25.02 32.26,25.78 31.5,26.54 29.34,26.54 28.19,27.69 v28.19,49.4 | v28.19,54.36 29.34,54.36 29.72,54.74 31.5,54.74 35.31,58.55 35.31,62.74 v35.05,62.99
  Bottom 0.254: IC2.2 43.18,61.34 38.29,66.23 | 38.29,66.23 34.29,70.23 T.27 | BUS.46 16.51,4.7 17.91,6.1 17.91,6.86 21.46,10.41 v21.46,14.48 | v28.19,54.36 v28.19,49.4 | 38.29,66.23 v35.05,62.99
A14  (via drill 0.35)
  Top 0.254: v19.43,14.35 19.43,32 v20.45,33.02 | v20.45,38.61 20.45,42.55 v27.05,49.15 | v29.34,57.15 31.37,57.15 34.8,60.58 34.8,62.1 34.29,62.61 34.29,63.75 v34.54,64.01
  Bottom 0.254: IC2.4 41.02,55.88 34.29,62.61 34.29,64.01 | 34.29,64.01 34.29,68.96 31.75,71.5 T.29 | BUS.47 13.97,8.89 v19.43,14.35 | v20.45,38.61 v20.45,33.02 | v27.05,49.15 27.05,54.86 v29.34,57.15 | 34.29,64.01 v34.54,64.01
A15  (via drill 0.35)
  Top 0.254: IC2.5 41.78,53.34 v38.1,57.02 | v23.88,21.72 31.5,21.72 32.77,22.99 32.77,32.89 31.24,34.42 29.46,34.42 28.7,35.18 28.7,43.56 29.72,44.58 33.15,44.58 v35.94,47.37
  Bottom 0.254: v38.1,57.02 38.1,58.04 33.78,62.36 33.78,68.71 29.21,73.28 T.31 | BUS.48 13.08,3.81 11.94,4.95 10.79,4.95 10.03,5.71 10.03,7.87 v23.88,21.72 | v35.94,47.37 36.2,47.37 42.16,53.34 IC2.5
CLK  (via drill 0.35)
  Top 0.254: v80.77,35.18 80.77,42.93 82.3,44.45 82.3,62.1 80.77,63.63 80.77,68.45 v78.23,70.99
  Bottom 0.254: BUS.1 72.39,6.73 80.77,15.11 v80.77,35.18 | v78.23,70.99 78.23,75.31 69.34,84.2 59.69,84.2 58.29,82.8 58.29,82.04 57.66,81.41 49.02,81.41 48.13,82.3 48.13,83.06 46.48,84.71 33.91,84.71 T.30
D0  (via drill 0.35)
  Top 0.254: IC1.34 36.32,48.26 v39.62,44.96 | v44.32,43.81 44.32,37.59 45.85,36.07 45.85,35.05 42.42,31.62 42.16,31.62 41.4,30.86 41.4,19.94 42.42,18.92 44.2,18.92 45.21,17.91 45.21,9.91 41.91,6.6 BUS.25 | T.2 66.42,82.55 64.26,84.71 32.26,84.71 30.35,82.8 30.35,82.04 29.46,81.15 v28.32,81.15
  Bottom 0.254: v39.62,44.96 43.18,44.96 v44.32,43.81 | v28.32,81.15 28.32,80.77 28.07,80.52 28.07,73.53 30.99,70.61 30.99,65.91 32.77,64.14 32.77,56.01 31.24,54.48 29.46,54.48 28.7,53.72 28.7,50.04 IC1.34
D1  (via drill 0.35)
  Top 0.254: v11.05,46.86 7.87,46.86 6.35,48.39 3.3,48.39 1.65,50.04 1.65,71.88 17.4,87.63 65.91,87.63 70.61,82.93 70.61,81.92 | 70.61,81.92 70.1,81.41 65.91,81.41 T.4 | v49.4,7.87 51.94,10.41 v51.94,10.67 | v76.45,33.66 76.45,35.18 80.01,38.73 v80.01,39.88 | 70.61,81.92 v78.99,73.53
  Bottom 0.254: IC1.33 29.08,45.72 27.05,43.69 19.43,43.69 16.26,46.86 v11.05,46.86 | BUS.26 41.02,3.81 39.88,2.67 38.86,2.67 38.23,3.3 38.23,4.32 39.12,5.21 39.88,5.21 40.77,6.1 40.77,6.86 41.78,7.87 v49.4,7.87 | v51.94,10.67 52.58,10.67 54.48,8.76 69.34,8.76 76.45,15.88 v76.45,33.66 | v80.01,39.88 83.06,42.93 83.06,69.47 v78.99,73.53
D2  (via drill 0.35)
  Top 0.254: IC1.32 33.02,43.18 36.2,46.35 v36.32,46.35 | v45.97,57.66 45.97,59.82 45.72,60.07 45.72,66.93 v45.97,67.18 | v59.05,66.29 59.05,68.58 59.94,69.47 59.94,69.85 62.48,72.39 v62.48,78.61
  Bottom 0.254: v36.32,46.35 36.32,46.61 40.39,50.67 40.39,50.8 41.78,52.2 44.2,52.2 45.97,53.98 v45.97,57.66 | v45.97,67.18 48.26,67.18 50.29,65.15 57.66,65.15 | 57.66,65.15 57.91,65.15 v59.05,66.29 | v62.48,78.61 63.37,79.5 63.37,81.41 T.6 | BUS.27 42.04,9.02 44.32,9.02 45.59,10.29 46.23,10.29 47.24,11.3 51.44,11.3 51.56,11.43 52.71,11.43 53.72,10.41 68.71,10.41 72.26,13.97 72.39,13.97 75.69,17.27 75.69,40.64 75.18,41.15 75.18,50.55 72.9,52.83 72.9,56.26 71.88,57.28 64.01,57.28 59.44,61.85 58.04,61.85 57.66,62.23 57.66,65.15
D3  (via drill 0.35)
  Top 0.254: v41.53,40.64 v38.61,40.64 | v59.56,28.83 59.56,22.35 58.29,21.08 57.79,21.08 56.52,19.81 56.52,7.37 55.75,6.6 55.75,3.3 55.12,2.67 v53.72,2.67 | v75.95,73.03 77.6,73.03 78.36,72.26 78.87,72.26 83.57,67.56 83.57,11.05 v74.93,2.41
  Bottom 0.254: v38.61,40.64 IC1.31 | v41.53,40.64 52.58,40.64 59.56,33.66 v59.56,28.83 | BUS.28 40.77,5.21 45.09,5.21 45.85,4.45 45.85,3.3 46.48,2.67 v53.72,2.67 53.98,2.41 v74.93,2.41 | T.8 60.58,82.55 61.72,83.69 65.28,83.69 66.17,82.8 66.17,82.04 67.06,81.15 67.82,81.15 v75.95,73.03
D4  (via drill 0.35)
  Top 0.254: IC1.30 30.48,37.72 34.67,33.53 34.67,26.29 39.88,21.08 39.88,17.53 40.13,17.27 v40.13,8.38 | v17.27,64.77 17.27,58.29 16,57.02 5.33,57.02 4.06,55.75 3.3,55.75 2.67,55.12 2.67,54.1 3.56,53.21 4.32,53.21 5.21,52.32 v5.21,51.18
  Bottom 0.254: v40.13,8.38 38.86,8.38 BUS.29 | T.10 56.26,82.55 52.32,86.49 21.34,86.49 17.27,82.42 v17.27,64.77 | v5.21,51.18 5.59,51.18 12.45,44.32 18.03,44.32 21.84,40.51 27.69,40.51 30.1,38.1 IC1.30
D5  (via drill 0.35)
  Top 0.254: IC1.29 30.86,35.56 34.16,32.26 34.16,26.04 39.37,20.83 39.37,17.27 39.62,17.02 39.62,9.02 37.97,7.37 37.97,4.95 BUS.30 | v26.29,39.75 v26.29,44.96
  Bottom 0.254: T.12 53.72,82.55 50.29,85.98 23.37,85.98 20.19,82.8 20.19,82.04 19.3,81.15 18.54,81.15 17.91,80.52 17.91,69.09 22.35,64.64 31.5,64.64 32.26,63.88 32.26,60.58 31.24,59.56 29.46,59.56 26.04,56.13 26.04,45.21 v26.29,44.96 | IC1.29 v26.29,39.75
D6  (via drill 0.35)
  Top 0.254: v36.45,17.4 36.45,16.64 36.83,16.26 36.83,11.68 34.29,9.14 BUS.31 | v27.3,85.22 25.27,83.19 25.27,82.04 24.38,81.15 23.62,81.15 22.73,80.26 v22.73,77.72 | v21.08,70.99 21.08,70.61 23.11,68.58 v23.11,56.64
  Bottom 0.254: v36.45,17.4 36.45,20.57 36.2,20.83 36.2,27.05 30.48,32.77 IC1.28 32.26,34.8 32.26,38.48 31.5,39.24 29.72,39.24 28.7,40.26 28.7,41.02 29.46,41.78 31.24,41.78 32.26,42.8 32.26,46.1 31.5,46.86 29.46,46.86 26.8,44.2 24,44.2 21.34,46.86 21.34,47.62 23.11,49.4 v23.11,56.64 | T.14 51.18,82.55 48.51,85.22 v27.3,85.22 | v22.73,77.72 21.08,76.07 v21.08,70.99
D7  (via drill 0.35)
  Top 0.254: v35.69,20.19 39.12,16.76 39.12,10.29 35.43,6.6 35.43,4.95 BUS.32 | T.16 49.53,81.66 50.93,80.26 50.93,77.72 58.29,70.36 58.29,65.28 59.94,63.63 v59.94,60.2 | v64.39,51.94 60.2,47.75 60.2,40.39 v59.94,40.13 | v45.09,39.88 v46.61,41.4 | v38.61,35.18 38.61,29.84 v35.43,26.67
  Bottom 0.254: 34.86,26.1 35.69,25.27 v35.69,20.19 | 34.86,26.1 IC1.27 | v59.94,60.2 59.94,59.82 64.39,55.37 v64.39,51.94 | v59.94,40.13 56.26,40.13 54.99,41.4 v46.61,41.4 | v45.09,39.88 43.31,39.88 v38.61,35.18 | 34.86,26.1 v35.43,26.67
E0H
  Top 0.254: IC4.9 75.82,45.72 71.88,49.66 69.34,49.66 64.39,54.61 CSLB.1
F0H
  Top 0.254: IC4.7 69.98,48.26 65.02,53.21 62.1,53.21 CSLB.3
F8H
  Top 0.254: IC3.15 73.28,30.48 72.14,31.62 65.53,31.62 64.39,30.48 CSHB.1
F9H
  Top 0.254: IC3.14 73.28,27.94 72.14,29.08 62.87,29.08 61.72,27.94 CSHB.3
FAH
  Top 0.254: IC3.13 73.28,25.4 72.14,26.54 62.1,26.54 CSHB.5
FBH
  Top 0.254: IC3.12 73.28,22.86 72.14,24 62.1,24 CSHB.7
GND  (via drill 0.35)
  Top 0.508: IC2.7 43.18,36.83 C5.1 | v19.3,59.94 19.3,67.56 C1.1 | v22.22,75.56 T.33 26.8,79.88 27.18,79.88 33.66,73.41 v37.85,73.41 | IC2.13 IC2.12 | IC3.8 71.12,9.78 73.91,6.99 73.91,5.33 BUS.2 | v76.33,44.7 72.14,44.7 IC4.8 | IC5.13 52.45,27.94 56.52,32 62.36,32 62.99,31.37 64.01,31.37 67.44,34.8 69.09,34.8 C3.1
  Bottom 0.508: C5.1 44.45,32.89 47.88,29.46 47.88,28.83 48.64,28.07 50.67,28.07 IC5.13 IC5.12 50.55,25.4 48.64,23.5 48.64,20.45 43.43,15.24 IC5.7 43.05,15.11 39.37,15.11 37.97,13.72 29.21,13.72 27.3,15.62 19.05,15.62 11.43,8 BUS.49 | IC1.7 16.13,48.26 17.91,50.04 17.91,53.59 18.54,54.23 18.67,54.23 19.3,54.86 v19.3,59.94 | v22.22,75.56 22.22,70.48 C1.1 | IC2.13 50.55,60.96 44.45,67.06 C2.1 44.32,68.71 40.89,68.71 37.72,71.88 37.72,72.9 37.85,73.03 v37.85,73.41 | C3.1 72.39,38.73 73.28,39.62 73.28,43.56 IC4.8 70.99,45.85 62.48,45.85 56.9,51.44 56.9,52.58 51.05,58.42 IC2.12 | C4.1 72.39,65.02 76.33,61.09 v76.33,44.7 76.45,44.58 76.45,41.78 81.91,36.32 81.91,13.72 72.39,4.19 BUS.2
  pour Bottom: -1.27,90.17 -1.27,-1.27 87.63,-1.27 87.63,90.17
PA0
  Bottom 0.254: IC1.4 11.3,55.88 8.38,58.8 4.57,58.8 4.32,58.55 3.3,58.55 2.16,59.69 2.16,70.74 P.1
PA1
  Top 0.254: IC1.3 9.27,58.42 4.06,63.63 3.3,63.63 2.67,64.26 2.67,68.71 P.2
PA2
  Bottom 0.254: IC1.2 10.16,60.96 P.3
PA3
  Top 0.254: IC1.1 5.08,63.5 P.4
PA4
  Bottom 0.254: IC1.40 17.4,63.5 12.45,68.45 3.3,68.45 2.67,67.82 2.67,63.37 P.5
PA5
  Bottom 0.254: IC1.39 17.4,60.96 16.13,59.69 P.6
PA6  (via drill 0.35)
  Top 0.254: v26.16,58.42 IC1.38 | v19.05,53.09 17.14,53.09 16,51.94 7.11,51.94 5.59,50.42 4.57,50.42 4.06,50.93 3.3,50.93 2.16,52.07 2.16,55.5 P.7
  Bottom 0.254: v26.16,58.42 22.86,58.42 20.19,55.75 20.19,54.23 v19.05,53.09
PA7
  Top 0.254: IC1.37 22.61,55.88 21.34,54.61 P.8
PB0  (via drill 0.35)
  Top 0.254: IC1.18 9.27,20.32 v7.11,22.48 | v7.11,45.72 v7.11,38.48
  Bottom 0.254: v7.11,38.48 v7.11,22.48 | v7.11,45.72 7.11,48.13 3.81,51.44 P.9
PB1  (via drill 0.35)
  Top 0.254: v17.02,37.34 17.02,41.02 16,42.04 14.22,42.04 13.46,42.8 13.46,43.56 14.48,44.58 16.26,44.58 17.02,45.34 17.02,46.1 16.26,46.86 12.19,46.86 9.53,49.53 P.10
  Bottom 0.254: IC1.19 15.24,18.16 17.02,19.94 v17.02,37.34
PB2
  Bottom 0.254: IC1.20 6.73,15.24 4.32,12.83 3.3,12.83 2.16,13.97 2.16,43.31 2.67,43.81 2.67,45.85 P.11
PB3
  Top 0.254: IC1.21 24.13,15.24 21.59,12.7 3.43,12.7 1.65,14.48 1.65,42.29 P.12
PB4
  Top 0.254: IC1.22 25.91,17.78 21.34,13.21 6.22,13.21 4.06,15.37 3.3,15.37 2.16,16.51 2.16,40.26 P.13
PB5
  Bottom 0.254: IC1.23 30.48,20.7 32.26,22.48 32.26,23.24 31.24,24.26 29.46,24.26 22.35,31.37 22.35,37.85 18.41,41.78 6.22,41.78 P.14
PB6
  Bottom 0.254: IC1.24 29.46,22.86 19.68,32.64 19.68,35.81 16.26,39.24 6.22,39.24 P.15
PB7
  Top 0.254: IC1.25 29.21,25.4 20.19,34.42 18.54,34.42 16.26,36.7 8.89,36.7 6.48,34.29 P.16
PC0
  Top 0.254: IC1.14 5.08,30.48 P.17
PC1
  Top 0.254: IC1.15 5.08,27.94 P.18
PC2
  Top 0.254: IC1.16 5.08,25.4 P.19
PC3
  Top 0.254: IC1.17 9.53,22.86 8.26,24.13 P.20
PC4
  Bottom 0.254: IC1.13 15.24,32.64 8.64,26.04 8.64,22.86 7.37,21.59 P.21
PC5
  Top 0.254: IC1.12 9.02,35.56 6.35,32.89 3.3,32.89 2.67,32.26 2.67,20.19 P.22
PC6  (via drill 0.35)
  Top 0.254: v7.87,23.37 6.86,23.37 4.95,21.46 4.95,17.65 P.23
  Bottom 0.254: IC1.11 15.24,37.72 7.87,30.35 v7.87,23.37
PC7
  Bottom 0.254: IC1.10 6.73,40.64 4.06,37.97 3.3,37.97 2.67,37.34 2.67,15.11 P.24
RESET
  Top 0.254: IC2.8 45.72,48.26 44.32,49.66 37.21,49.66 36.13,50.74 | 36.13,50.74 36.07,50.8 IC1.35 | T.39 19.05,77.09 25.15,70.99 30.99,70.99 36.83,65.15 36.83,51.44 36.13,50.74
VCC  (via drill 0.35)
  Top 0.508: v25.02,45.59 v25.02,33.15 | v25.02,57.4 25.02,68.2 C1.2 | v10.41,1.78 10.41,2.67 9.91,3.17 9.91,6.99 12.95,10.03 22.22,10.03 22.73,10.54 31.62,10.54 34.16,13.08 | 34.16,13.08 35.94,14.86 35.94,15.88 35.31,16.51 v35.31,18.92 | IC2.14 50.8,67.31 C2.2 | IC5.14 53.47,30.48 56.26,33.27 63.5,33.27 | 63.5,33.27 64.39,33.27 66.93,35.81 68.07,35.81 71.88,39.62 | 71.88,39.62 75.95,39.62 76.07,39.5 | C3.2 76.07,39.5 | v62.74,48.77 62.99,48.77 70.99,40.77 70.99,40.51 71.88,39.62 | C4.2 78.74,67.31 IC4.16 78.87,63.63 81.41,61.09 81.41,44.83 76.07,39.5 | T.34 27.05,82.55 30.1,85.6 66.42,85.6 v69.6,82.42 | v35.43,11.81 34.16,13.08 | 63.5,33.27 v63.5,32.51
  Bottom 0.508: v25.02,33.15 30.23,27.94 IC1.26 30.61,27.81 31.5,27.81 33.66,25.65 33.66,20.57 v35.31,18.92 | v25.02,57.4 v25.02,45.59 | BUS.24 44.07,3.81 41.53,1.27 10.92,1.27 v10.41,1.78 | IC5.14 50.8,32.89 49.53,34.16 C5.2 | IC3.16 78.74,36.83 C3.2 | IC2.14 54.23,63.5 62.74,54.99 v62.74,48.77 | v69.6,82.42 69.6,81.03 77.09,73.53 77.09,68.96 C4.2 | v35.43,11.81 36.96,11.81 37.85,10.92 43.43,10.92 44.7,12.19 45.34,12.19 46.86,13.72 53.98,13.72 64.01,23.75 64.01,32 v63.5,32.51
  pour Top: -1.27,90.17 -1.27,-1.27 86.36,-1.27 87.63,0 87.63,90.17

### Text on the board
tNames: !M1 | !WR | !RD | D7 | D6 | D5 | D4 | D3 | D2 | D1 | D0 | !CSHB | !CSLB | !CS | VCC | !HALT | CLK | !MREQ | !RESET | !IORQ | A15 | A14 | A13 | A12 | A11 | A10 | A9 | A8 | A7 | A6 | A5 | A4 | A3 | A2 | A1 | A0 | !IOWR | !IORD | GND | RESET | A0 | RABS664 Amstrad CPC 8255 PIO V2.0 | 8255 | A7 | E0 | B0 | F0 | B7 | C0 | F8 | F9 | FA | FB | C7